# EAGLE schematic main (EAGLE 9.2.2)
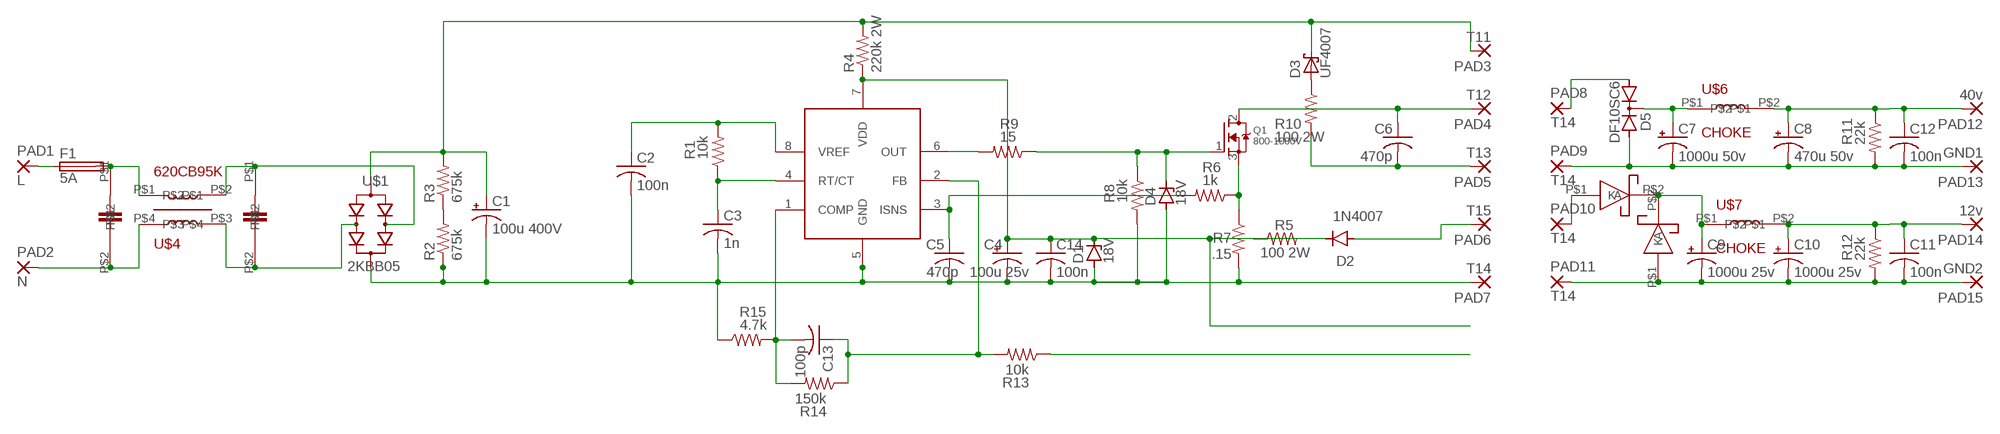
[diagram p0: schematic, sheet 1]

## Parts
C1  100u 400V  CPOL-USE10-25  [EB25D]
C2  100n  C-US050-035X075  [C050-035X075]
C3  1n  C-US050-035X075  [C050-035X075]
C4  100u 25v  CPOL-USE2.5-6  [E2,5-6]
C5  470p  C-US050-035X075  [C050-035X075]
C6  470p  C-US050-035X075  [C050-035X075]
C7  1000u 50v  CPOL-USE5-13  [E5-13]
C8  470u 50v  CPOL-USE5-10.5  [E5-10,5]
C9  1000u 25v  CPOL-USE5-10.5  [E5-10,5]
C10  1000u 25v  CPOL-USE5-10.5  [E5-10,5]
C11  100n  C-US050-035X075  [C050-035X075]
C12  100n  C-US050-035X075  [C050-035X075]
C13  100p  C-US050-035X075  [C050-035X075]
C14  100n  C-US050-035X075  [C050-035X075]
D1  18V  ZENER-DIODEZD-7.5  [ZDIO-7.5]
D2  1N4007  1N4004  [DO41-10]
D3  UF4007  SCHOTTKY-DIODEDO35-7  [DO35-7]
D4  18V  ZENER-DIODEZD-7.5  [ZDIO-7.5]
D5  DF10SC6  BYV32  [TO220ABS]
D7  SS34  [DO-214AB]
D8  SS34  [DO-214AB]
F1  5A  SH22,5  [SH22,5]
PAD1  L  2,54/1,0  [2,54/1,0]
PAD2  N  2,54/1,0  [2,54/1,0]
PAD3  T11  2,54/1,0  [2,54/1,0]
PAD4  T12  2,54/1,0  [2,54/1,0]
PAD5  T13  2,54/1,0  [2,54/1,0]
PAD6  T15  2,54/1,0  [2,54/1,0]
PAD7  T14  2,54/1,0  [2,54/1,0]
PAD8  T14  2,54/1,0  [2,54/1,0]
PAD9  T14  2,54/1,0  [2,54/1,0]
PAD10  T14  2,54/1,0  [2,54/1,0]
PAD11  T14  2,54/1,0  [2,54/1,0]
PAD12  40v  2,54/1,0  [2,54/1,0]
PAD13  GND1  2,54/1,0  [2,54/1,0]
PAD14  12v  2,54/1,0  [2,54/1,0]
PAD15  GND2  2,54/1,0  [2,54/1,0]
Q1  800-1000V  MOSFET-NGDS_TO220V  [TO220V]
R1  10k  R-US_0207/7  [0207/7]
R2  675k  R-US_0207/7  [0207/7]
R3  675k  R-US_0207/7  [0207/7]
R4  220k 2W  R-US_0613/15  [P0613/15]
R5  100 2W  R-US_0617/5V  [0617V]
R6  1k  R-US_0207/10  [0207/10]
R7  .15  R-US_0207/7  [0207/7]
R8  10k  R-US_0207/7  [0207/7]
R9  15  R-US_0207/7  [0207/7]
R10  100 2W  R-US_0617/5V  [0617V]
R11  22k  R-US_0207/7  [0207/7]
R12  22k  R-US_0207/7  [0207/7]
R13  10k  R-US_0207/7  [0207/7]
R14  150k  R-US_0207/7  [0207/7]
R15  4.7k  R-US_0207/2V  [0207/2V]
U$1  2KBB05  [2KBB05]
U$2  100n  C_X2  [C_X2]
U$3  100n  C_X2  [C_X2]
U$4  620CB95K  [602CB95K]
U$5  MIC3844  [DIL08]
U$6  CHOKE  [CHOKE]
U$7  CHOKE  [CHOKE]

## Nets
12V: C10.+ C11.1 PAD14.1(P) R12.1 U$7.P$2
12VRECT: C9.+ D7.P$2(K) D8.P$2(K) U$7.P$1
40V: C8.+ C12.1 PAD12.1(P) R11.1 U$6.P$2
40VRECT: C7.+ D5.C U$6.P$1
COMP: C13.2 R14.2 R15.2 U$5.1(COMP)
DRAIN: Q1.3(S) R6.1 R7.1
DRV: R9.2 U$5.6(OUT)
FB: C13.1 R13.2 R14.1 U$5.2(FB)
GATE: D4.C Q1.1(G) R8.1 R9.1
GND: C1.- C2.2 C3.2 C4.- C5.2 C14.2 D1.A D4.A PAD7.1(P) R2.1 R7.2 R8.2 R15.1 U$1.+ U$5.5(GND)
GND1: C7.- C8.- C12.2 D5.A2 PAD9.1(P) PAD13.1(P) R11.2
GND2: C9.- C10.- C11.2 D7.P$1(A) PAD11.1(P) PAD15.1(P) R12.2
N$1: R13.1
N$3: PAD2.1(P) U$3.P$2 U$4.P$4
N$4: U$1.AC@1(AC) U$2.P$2 U$4.P$3
N$5: U$1.AC@2(AC) U$2.P$1 U$4.P$2
N$6: F1.2 U$3.P$1 U$4.P$1
N$7: F1.1 PAD1.1(P)
N$9: R2.2 R3.1
N$11: D2.C R5.1
N$12: C5.1 R6.2 U$5.3(ISNS)
N$16: D2.A PAD6.1(P)
N$17: D3.A R10.1
N$18: C6.2 PAD5.1(P) R10.2
N$23: D5.A1 PAD8.1(P)
N$27: D8.P$1(A) PAD10.1(P)
RTCT: C3.1 R1.1 U$5.4(RT/CT)
SOURCE: C6.1 PAD4.1(P) Q1.2(D)
V+: C1.+ D3.C PAD3.1(P) R3.2 R4.2 U$1.-
VDD: C4.+ C14.1 D1.C R4.1 R5.2 U$5.7(VDD)
VREF: C2.1 R1.2 U$5.8(VREF)

## Library data of the parts
C1 C4 C7-C10 = rcl:CPOL-US: POLARIZED CAPACITOR, American symbol; SPICEPREFIX: C
C2 C3 C5 C6 C11-C14 = rcl:C-US: CAPACITOR, American symbol; SPICEPREFIX: C
D1 D4 = diode:ZENER-DIODE: Z-Diode
D2 = diode:1N4004: DIODE general purpose rectifier, 1 A
D3 = adafruit:SCHOTTKY-DIODE: Schottky Diode
D5 = diode:BYV32: DIODE 2 x Si diode 200 V, 20 A/230 Apeak, 25 ns
D7 D8 = 7_segment_lib:SS34
F1 = fuse:SH22,5: FUSE HOLDER grid 22,5 mm, OGN0031 8201, Schurter (Buerklin); MF: SCHURTER; MPN: 0031.8201; OC_FARNELL: 1162740; OC_NEWARK: 96F8317
PAD1-PAD15 = 7_segment_lib:2,54/1,0: THROUGH-HOLE PAD
Q1 = adafruit:MOSFET-N: N-Channel Mosfet 2N7002E - 60V 260mA SOT23 [Digikey: 2N7002ET1GOSTR-ND] - REEL BSH103 - 30V 850mA SOT23 [Digikey: 568-5013-1-ND]
R1-R15 = rcl:R-US_: RESISTOR, American symbol; SPICEPREFIX: R
U$1 = 7_segment_lib:2KBB05
U$2 U$3 = 7_segment_lib:C_X2
U$4 = 7_segment_lib:620CB95K
U$5 = 7_segment_lib:MIC3844
U$6 U$7 = 7_segment_lib:CHOKE